# EAGLE design D&D_dice_1 (EAGLE 6.1)
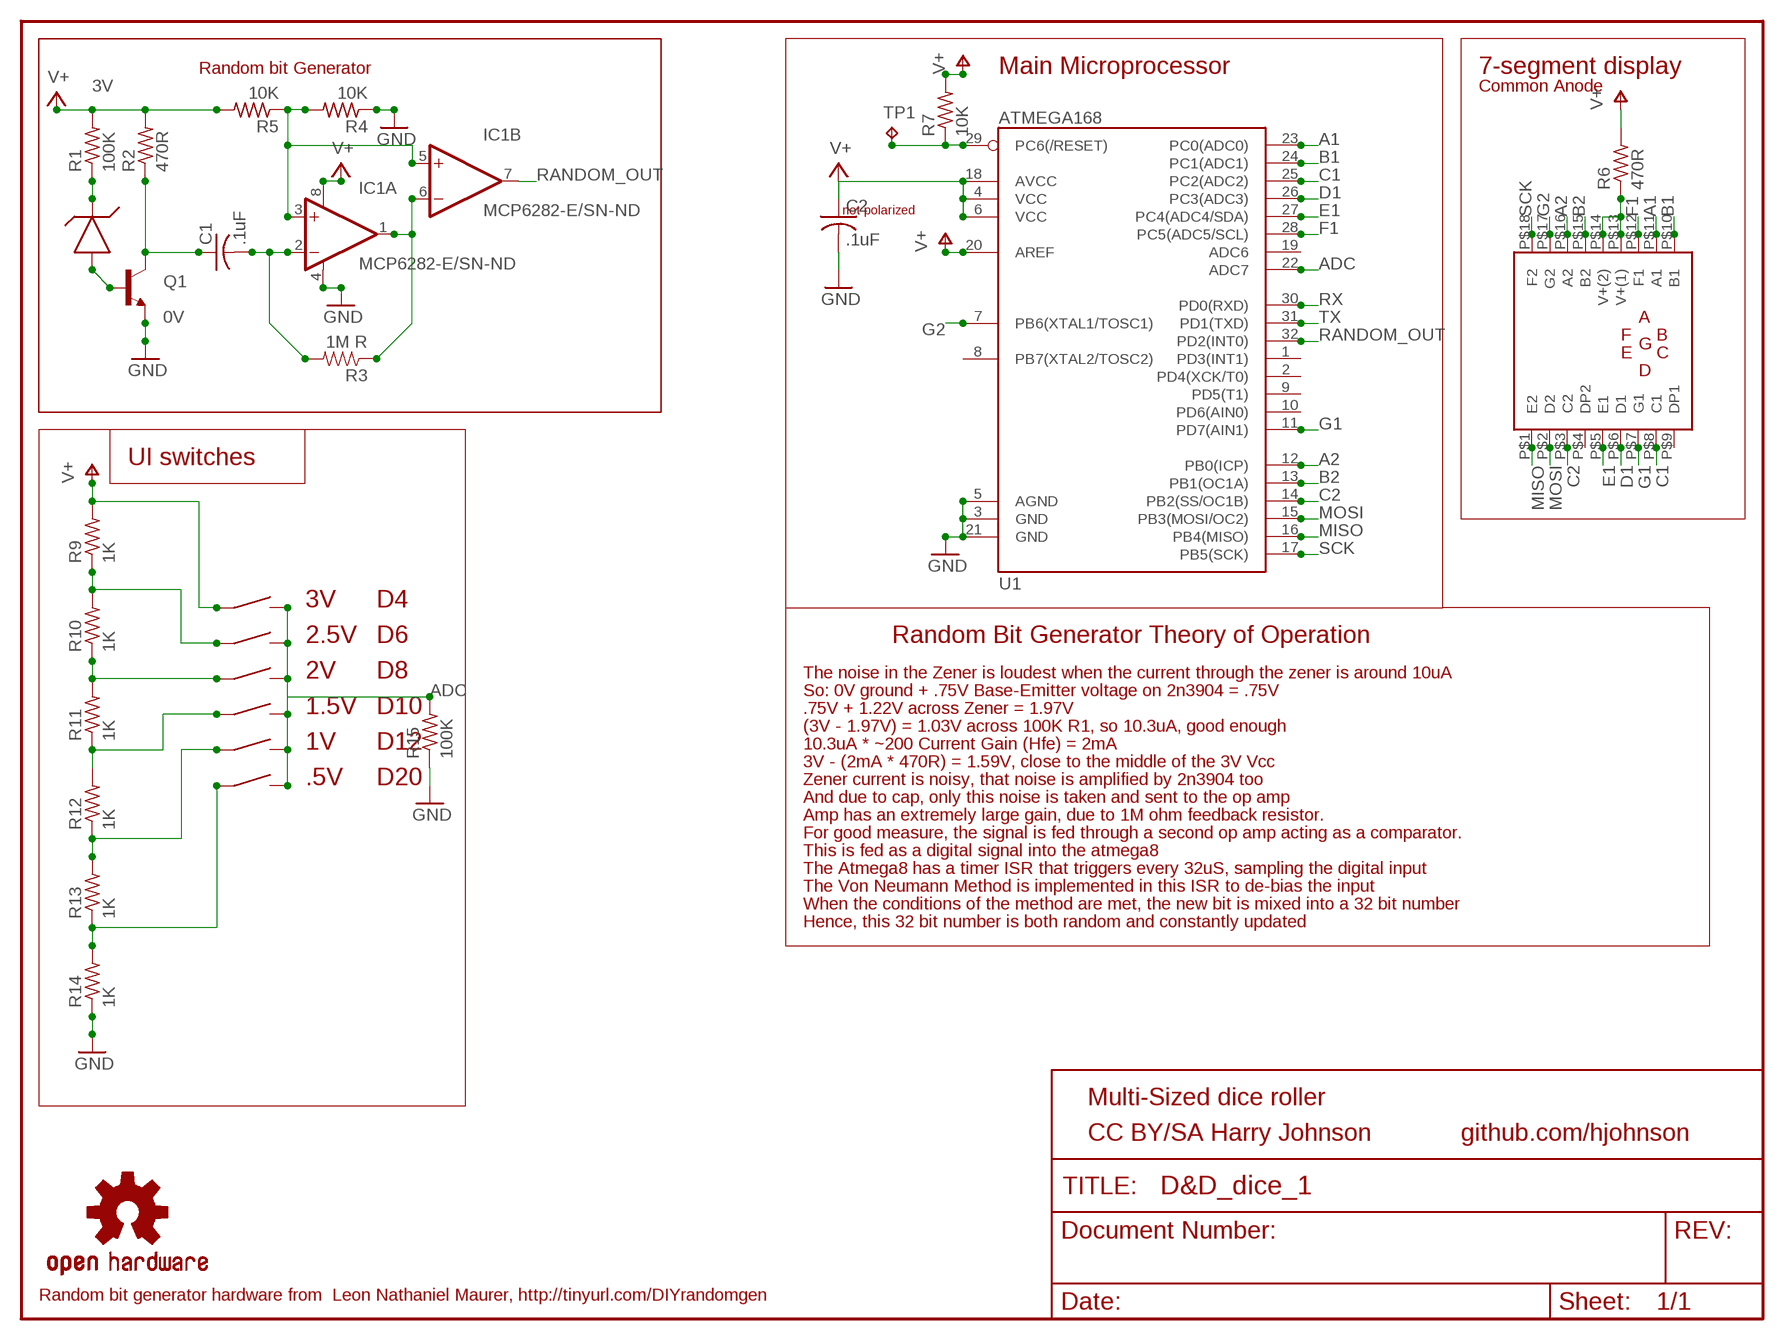
[diagram p0: schematic, sheet 1]

## Parts
C1  .1uF  C-USC0805  [C0805]
C2  .1uF  C-USC0805  [C0805]
IC1  MCP6282-E/SN-ND  OPA2340U  [SO08]
Q1  TRANSISTOR_NPNSOT23  [SOT23]
R1  100K  R-US_R0805  [R0805]
R2  470R  R-US_R0805  [R0805]
R3  1M R  RESISTOR0805-RES  [0805]
R4  10K  R-US_R0805  [R0805]
R5  10K  R-US_R0805  [R0805]
R6  470R  R-US_R0805  [R0805]
R7  10K  R-US_R0805  [R0805]
R9  1K  R-US_R0805  [R0805]
R10  1K  R-US_R0805  [R0805]
R11  1K  R-US_R0805  [R0805]
R12  1K  R-US_R0805  [R0805]
R13  1K  R-US_R0805  [R0805]
R14  1K  R-US_R0805  [R0805]
R15  100K  R-US_R0805  [R0805]
SW1  SPST_SWITCH  [EG2513-ND]
SW2  SPST_SWITCH  [EG2513-ND]
SW3  SPST_SWITCH  [EG2513-ND]
SW4  SPST_SWITCH  [EG2513-ND]
SW5  SPST_SWITCH  [EG2513-ND]
SW6  SPST_SWITCH  [EG2513-ND]
TP1  TPB1,27  [B1,27]
U1  ATMEGA168  [TQFP32-08]
U$1  ZXRE1004FFTA  [SOT23]
U$2  2DIGIT_7SEGMENT  [HDSP-521E]
U$3  OSHW-LOGOS  [OSHW-LOGO-S]

## Nets
/RES: R7.1 TP1.TP U1.29(PC6(/RESET))
A1: U1.23(PC0(ADC0)) U$2.P$11(A1)
A2: U1.12(PB0(ICP)) U$2.P$16(A2)
ADC: R15.2 SW1.P$2 SW2.P$2 SW3.P$2 SW4.P$2 SW5.P$2 SW6.P$2 U1.22(ADC7)
B1: U1.24(PC1(ADC1)) U$2.P$10(B1)
B2: U1.13(PB1(OC1A)) U$2.P$15(B2)
C1: U1.25(PC2(ADC2)) U$2.P$8(C1)
C2: U1.14(PB2(SS/OC1B)) U$2.P$3(C2)
D1: U1.26(PC3(ADC3)) U$2.P$6(D1)
E1: U1.27(PC4(ADC4/SDA)) U$2.P$5(E1)
F1: U1.28(PC5(ADC5/SCL)) U$2.P$12(F1)
G1: U1.11(PD7(AIN1)) U$2.P$7(G1)
G2: U1.7(PB6(XTAL1/TOSC1)) U$2.P$17(G2)
GND: C2.2 IC1.4(A:V-) Q1.2(E) R4.1 R14.1 R15.1 U1.3(GND) U1.5(AGND) U1.21(GND)
MISO: U1.16(PB4(MISO)) U$2.P$1(E2)
MOSI: U1.15(PB3(MOSI/OC2)) U$2.P$2(D2)
N$1: Q1.1(B) U$1.2(A)
N$2: C1.1 Q1.3(C) R2.1
N$3: R1.1 U$1.1(K)
N$4: C1.2 IC1.2(A:-IN) R3.2
N$5: IC1.1(A:OUT) IC1.6(B:-IN) R3.1
N$6: IC1.3(A:+IN) IC1.5(B:+IN) R4.2 R5.1
N$11: R6.1 U$2.P$13(V+(1)) U$2.P$14(V+(2))
RANDOM_OUT: IC1.7(B:OUT) U1.32(PD2(INT0))
ROLL_D6: R9.1 R10.2 SW2.P$1
ROLL_D8: R10.1 R11.2 SW3.P$1
ROLL_D10: R11.1 R12.2 SW4.P$1
ROLL_D12: R12.1 R13.2 SW5.P$1
ROLL_D20: R13.1 R14.2 SW6.P$1
RX: U1.30(PD0(RXD))
SCK: U1.17(PB5(SCK)) U$2.P$18(F2)
TX: U1.31(PD1(TXD))
V+: C2.1 IC1.8(A:V+) R1.2 R2.2 R5.2 R6.2 R7.2 R9.2 SW1.P$1 U1.4(VCC) U1.6(VCC) U1.18(AVCC) U1.20(AREF)
Unconnected: U1.1(PD3(INT1)) U1.2(PD4(XCK/T0)) U1.8(PB7(XTAL2/TOSC2)) U1.9(PD5(T1)) U1.10(PD6(AIN0)) U1.19(ADC6) U$2.P$4(DP2) U$2.P$9(DP1)

## Notes on the sheet
- Random bit Generator | Main Microprocessor | 7-segment display
- 3V | Common Anode
- not polarized
- 0V
- UI switches
- 3V | D4
- 2.5V | D6 | Random Bit Generator Theory of Operation
- 2V | D8 | The noise in the Zener is loudest when the current through the zener is around 10uA
- So: 0V ground + .75V Base-Emitter voltage on 2n3904 = .75V
- 1.5V | D10 | .75V + 1.22V across Zener = 1.97V
- (3V - 1.97V) = 1.03V across 100K R1, so 10.3uA, good enough
- 1V | D12 | 10.3uA * ~200 Current Gain (Hfe) = 2mA
- 3V - (2mA * 470R) = 1.59V, close to the middle of the 3V Vcc
- .5V | D20 | Zener current is noisy, that noise is amplified by 2n3904 too
- And due to cap, only this noise is taken and sent to the op amp
- Amp has an extremely large gain, due to 1M ohm feedback resistor.
- For good measure, the signal is fed through a second op amp acting as a comparator.
- This is fed as a digital signal into the atmega8
- The Atmega8 has a timer ISR that triggers every 32uS, sampling the digital input
- The Von Neumann Method is implemented in this ISR to de-bias the input
- When the conditions of the method are met, the new bit is mixed into a 32 bit number
- Hence, this 32 bit number is both random and constantly updated
- Multi-Sized dice roller
- CC BY/SA Harry Johnson | github.com/hjohnson
- Random bit generator hardware from  Leon Nathaniel Maurer, http://tinyurl.com/DIYrandomgen

## Library data of the parts
C1 C2 = adafruit:C-US: CAPACITOR, American symbol
IC1 = burr-brown:OPA2340: Single-Supply, Rail-to-Rail Operational Amplifiers MicroAmplifier(TM) Series; Product Folder:OPA2340; MF: TEXAS INSTRUMENTS; MPN: OPA2340UA; OC_FARNELL: 1101541; OC_NEWARK: 36K7581
Q1 = SparkFun:TRANSISTOR_NPN: Transistor NPN BJT configuration in SOT23 package. MMBT2222 is the common NPN we use. Double check BCE configuration again layout.
R1 R2 R4-R7 R9-R15 = adafruit:R-US_: RESISTOR, American symbol
R3 = SparkFun:RESISTOR: Resistor Basic schematic elements and footprints for 0603, 1206, and PTH resistors.
SW1-SW6 = hjohnson_library:SPST_SWITCH
TP1 = testpad:TP: Test pad
U1 = SparkFun:ATMEGA168
U$1 = hjohnson_library:ZXRE1004FFTA
U$2 = hjohnson_library:2DIGIT_7SEGMENT
U$3 = SparkFun:OSHW-LOGO: Open Source Hardware Logo This logo indicates the piece of hardware it is found on incorporates a OSHW license and/or adheres to the definition of open source hardware found here: http://freedomdefined.org/OSHW

## Board
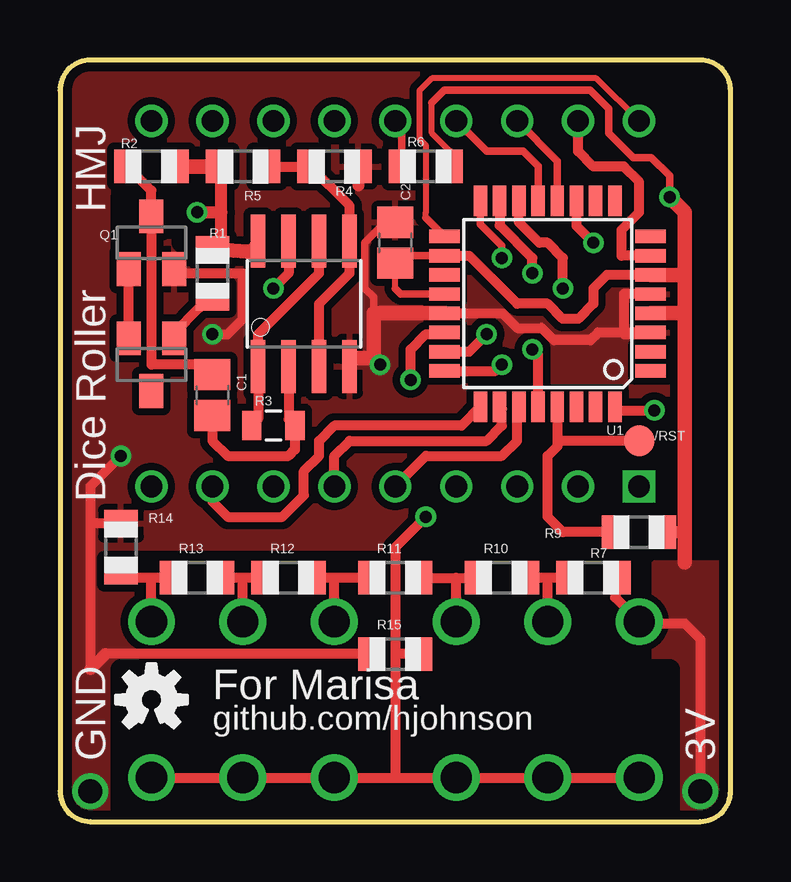
[diagram p1: board, top side]
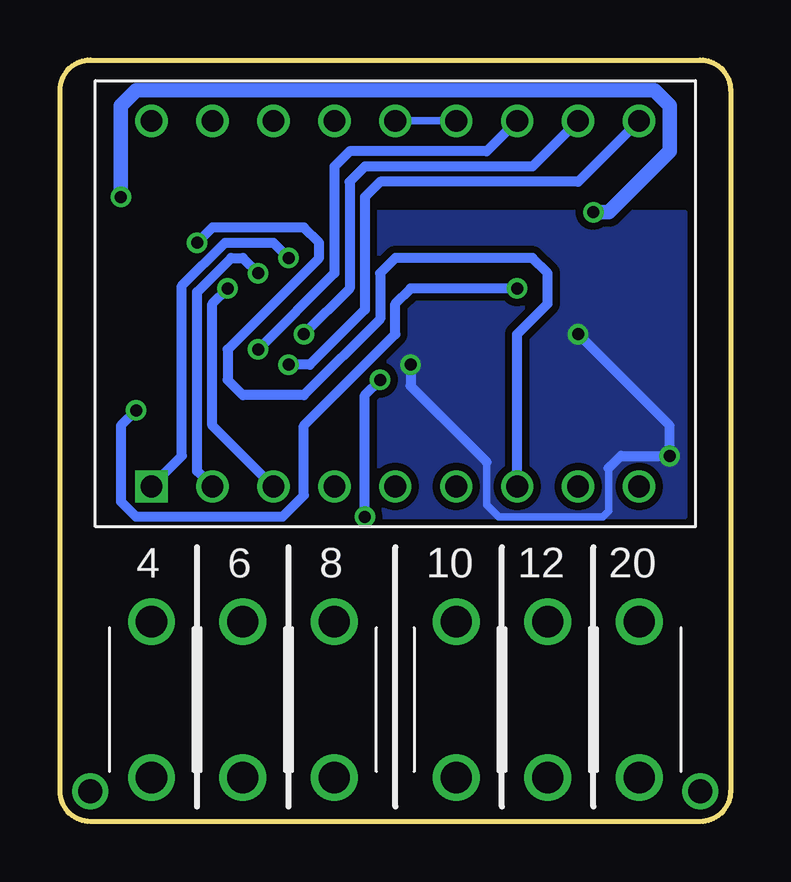
[diagram p2: board, bottom side, seen from below]

Size 27.94 x 31.75 mm. Coordinates in mm from the lower left corner, seen from the top.
Outline: 0,30.48 0,1.27 arc90 1.27,0 26.67,0 arc90 27.94,1.27 27.94,30.48 arc90 26.67,31.75 1.27,31.75 arc90 0,30.48
Copper layers (1*16): Top 0.0356mm / dielectric 1.5011mm / Bottom 0.0356mm
Design rules: minimum track width 6mil, minimum drill 13mil, track to track 6mil, track to pad 6mil, pad to pad 6mil, via to via 6mil, smd to smd 6mil, copper to edge 15mil, drill to drill 6mil, minimum pad ring 7mil, minimum via ring 7mil, stop-mask expansion 4mil, vias tented up to drill 0mil, thermal gap 10mil
tRestrict: 23 lines

### Footprints (pad centres in the part's own frame; a part is rotated, then mirrored left to right if it is on the bottom)
C0805 = smd 1.3 x 1.5: 1 -0.85,0; 2 0.85,0
SO08 = smd 0.61 x 2.21: 1 -1.905,-2.616; 2 -0.635,-2.616; 3 0.635,-2.616; 4 1.905,-2.616; 5 1.905,2.616; 6 0.635,2.616; 7 -0.635,2.616; 8 -1.905,2.616
SOT23 = smd 1 x 1.4: 1 -0.95,-1.1; 2 0.95,-1.1; 3 0,1.1
R0805 = smd 1.1 x 1.4: 1 -1,0; 2 1,0
0805 = smd 0.8 x 1.2: 1 -0.9,0; 2 0.9,0
EG2513-ND = drill 1.3: P$1 -3.25,0; P$2 3.25,0
B1,27 = smd 1.27 x 1.27: TP 0,0
TQFP32-08 = smd 1.27 x 0.559: 1 -4.293,2.8; 2 -4.293,2; 3 -4.293,1.2; 4 -4.293,0.4; 5 -4.293,-0.4; 6 -4.293,-1.2; 7 -4.293,-2; 8 -4.293,-2.8; 17 4.293,-2.8; 18 4.293,-2; 19 4.293,-1.2; 20 4.293,-0.4; 21 4.293,0.4; 22 4.293,1.2; 23 4.293,2; 24 4.293,2.8 | smd 0.559 x 1.27: 9 -2.8,-4.293; 10 -2,-4.293; 11 -1.2,-4.293; 12 -0.4,-4.293; 13 0.4,-4.293; 14 1.2,-4.293; 15 2,-4.293; 16 2.8,-4.293; 25 2.8,4.293; 26 2,4.293; 27 1.2,4.293; 28 0.4,4.293; 29 -0.4,4.293; 30 -1.2,4.293; 31 -2,4.293; 32 -2.8,4.293
HDSP-521E = drill 0.9 square: P$1 -10.16,-7.62 | drill 0.9: P$2 -7.62,-7.62; P$3 -5.08,-7.62; P$4 -2.54,-7.62; P$5 0,-7.62; P$6 2.54,-7.62; P$7 5.08,-7.62; P$8 7.62,-7.62; P$9 10.16,-7.62; P$10 10.16,7.62; P$11 7.62,7.62; P$12 5.08,7.62; P$13 2.54,7.62; P$14 0,7.62; P$15 -2.54,7.62; P$16 -5.08,7.62; P$17 -7.62,7.62; P$18 -10.16,7.62

### Placement (x,y rotation side)
C1  6.35,17.78 270 top
C2  13.97,24.13 90 top
IC1  10.16,21.59 0 top
Q1  3.81,24.13 0 top
R1  6.35,22.86 90 top
R2  3.81,27.3 0 top
R3  8.89,16.51 0 top
R4  11.43,27.3 180 top
R5  7.62,27.3 180 top
R6  15.24,27.3 0 top
R7  24.13,12.06 0 top
R9  22.23,10.16 0 top
R10  18.41,10.16 0 top
R11  13.97,10.16 0 top
R12  9.53,10.16 0 top
R13  5.71,10.16 0 top
R14  2.54,11.43 270 top
R15  13.97,6.99 0 top
SW1  24.13,5.08 270 bottom
SW2  20.32,5.08 270 bottom
SW3  16.51,5.08 270 bottom
SW4  11.43,5.08 270 bottom
SW5  7.62,5.08 270 bottom
SW6  3.81,5.08 270 bottom
TP1  24.13,15.88 0 top
U1  20.32,21.59 180 top
U$1  3.81,19.05 180 top
U$2  13.97,21.59 0 bottom
U$3  3.81,5.08 0 top

### Tracks (layer width: path | path; a pad name or v marks a point on that pad's centre or on a via)
/RES
  Top 0.406: R7.1 20.95,12.06 20.32,12.7 20.32,15.24 20.72,15.64 20.72,15.88 | U1.29 20.72,15.88 | TP1.TP 20.72,15.88
A1  (via drill 0.5)
  Top 0.406: U1.23 17.05,19.59 v17.78,20.32
  Bottom 0.406: U$2.P$11 8.26,27.3 15.24,27.3 15.88,26.67 15.88,22.23 v17.78,20.32
A2
  Top 0.305: U$2.P$16 20.72,27.54 U1.12
ADC  (via drill 0.5)
  Top 0.406: SW6.P$2 SW5.P$2 SW4.P$2 13.97,1.83 | 13.97,1.83 SW3.P$2 SW2.P$2 SW1.P$2 | v15.24,12.7 13.97,11.43 13.97,6.99 | 13.97,6.99 13.97,1.83 | R15.2 13.97,6.99 | v14.61,18.41 14.61,19.68 15.24,20.32 15.96,20.32 U1.22
  Bottom 0.406: v15.24,12.7 15.24,17.78 v14.61,18.41
B1  (via drill 0.5)
  Top 0.406: U1.24 18.16,18.79 v18.41,19.05
  Bottom 0.406: U$2.P$10 6.35,26.67 14.61,26.67 15.24,26.04 15.24,21.34 17.53,19.05 v18.41,19.05
B2
  Top 0.305: U$2.P$15 17.78,27.94 19.3,27.94 19.92,27.32 U1.13
C1
  Top 0.406: U$2.P$8 6.35,13.34 6.99,12.7 9.26,12.7 10.16,13.6 10.16,14.61 10.79,15.24 10.79,15.88 11.43,16.51 16.73,16.51 U1.25
C2  (via drill 0.5)
  Top 0.254: U1.14 19.12,25.47
  Top 0.406: 19.05,25.4 19.12,25.47 19.12,24.98 19.97,24.13 20.32,24.13 20.95,23.5 v20.95,22.23
  Bottom 0.406: U$2.P$3 21.59,16.51 21.59,21.59 v20.95,22.23
D1
  Top 0.254: 18.41,17.2 U1.26
  Top 0.406: U$2.P$6 11.43,15.24 12.06,15.88 17.78,15.88 18.41,16.51 18.41,17.2
E1
  Top 0.254: 19.05,17.23 U1.27
  Top 0.406: U$2.P$5 15.24,15.24 18.41,15.24 19.05,15.88 19.05,17.23
F1  (via drill 0.5)
  Top 0.406: U1.28 19.92,19.45 v19.68,19.68
  Bottom 0.406: v19.68,19.68 16.51,22.86 16.51,27.3 15.88,27.94 10.16,27.94 U$2.P$12
G1  (via drill 0.5)
  Top 0.406: U1.11 21.52,24.84 v22.23,24.13
  Bottom 0.406: U$2.P$7 8.89,20.32 7.62,21.59 7.62,22.86 8.26,23.5 13.97,23.5 14.61,22.86 14.61,20.95 17.78,17.78 20.32,17.78 20.95,18.41 20.95,19.68 17.14,23.5 17.14,24.13 17.78,24.77 21.59,24.77 v22.23,24.13
G2
  Top 0.406: U1.7 23.4,23.59 23.4,24.67 24.13,25.4 24.13,26.67 23.5,27.3 22.23,27.3 21.59,27.94 U$2.P$17
GND  (via drill 0.5, 1)
  Top 0.254: 5.08,22.86 4.91,23.03 Q1.2 4.76,22.86 | 12.06,19.05 IC1.4
  Top 0.305: 13.07,21.19 13.07,21.86 12.7,22.23 12.7,24.13 13.55,24.98
  Top 0.406: v2.54,15.24 1.27,13.97 1.27,12.43 | v6.35,20.32 6.99,20.32 7.62,20.95 7.62,22.86 4.76,22.86 | 1.27,12.43 1.27,6.35 | R15.1 1.91,6.99 | R14.1 1.27,12.43 | U1.5 23.5,21.99 23.5,20.32 24.61,20.32 U1.3 22.42,20.39 22.1,20.07 20.57,20.07 20.07,20.57 19.05,20.57 18.43,21.19 U1.21 | 13.07,19.32 v13.34,19.05
  Top 0.508: R4.1 12.43,26.52 | 1.91,6.99 1.27,6.35
  Top 0.61: U1.21 13.07,21.19 13.07,19.32 12.06,19.32 IC1.4
  Bottom 0.305: 10.16,14.99 10.16,13.21 9.65,12.7 5.33,12.7 5.08,12.95 5.08,14.73
  Bottom 0.406: v6.35,20.32 2.54,16.51 v2.54,15.24 4.57,15.24 5.08,14.73 | 10.16,14.99 13.34,18.16 v13.34,19.05
  other vias: 1.27,1.27
  pour Bottom (isolate 0.305): 1.91,12.7 26.04,12.7 26.04,25.4 1.91,25.4
  pour Top (isolate 0.305): 0,0 3.17,0 3.17,11.43 27.94,11.43 27.94,31.75 0,31.75
MISO  (via drill 0.5)
  Top 0.305: U1.16 17.52,24.9 18.41,24 v18.41,23.5
  Bottom 0.406: v18.41,23.5 19.05,24.13 21.06,24.13 22.86,22.33 22.86,15.24 U$2.P$1
MOSI  (via drill 0.5)
  Top 0.406: v19.68,22.86 19.68,23.5 18.32,24.86 U1.15
  Bottom 0.406: v19.68,22.86 20.32,23.5 20.8,23.5 22.23,22.07 22.23,14.61 U$2.P$2
N$1
  Top 0.406: U$1.2 Q1.1
N$2
  Top 0.406: 2.54,27.3 R2.1 3.81,26.3 Q1.3 3.81,19.05 5.71,19.05 6.13,18.63 C1.1
N$3
  Top 0.406: R1.1 5.81,21.42 4.76,20.37 U$1.1
N$4
  Top 0.406: IC1.2 9.53,16.77 R3.2 9.79,15.51 9.53,15.24 6.99,15.24 6.35,15.88 C1.2
N$5
  Top 0.406: IC1.6 10.79,22.86 8.26,20.32 IC1.1 8.26,16.77 R3.1
N$6
  Top 0.406: R5.1 R4.2 12.06,25.67 IC1.5 12.06,22.86 10.79,21.59 IC1.3
N$11
  Top 0.305: R6.1 14.24,28.94 U$2.P$14
  Bottom 0.305: U$2.P$13 U$2.P$14
RANDOM_OUT  (via drill 0.5)
  Top 0.406: U1.32 23.27,17.14 v24.77,17.14 | IC1.7 9.53,22.86 v8.89,22.23
  Bottom 0.406: v8.89,22.23 13.34,22.23 13.97,21.59 13.97,20.32 17.78,16.51 17.78,13.6 18.68,12.7 24.77,12.7 25.4,13.34 25.4,16.51 v24.77,17.14
ROLL_D6
  Top 0.406: R9.1 20.32,10.16 | 20.32,10.16 R10.2 | SW2.P$1 20.32,10.16
ROLL_D8
  Top 0.406: R11.2 16.51,10.16 | 16.51,10.16 R10.1 | SW3.P$1 16.51,10.16
ROLL_D10
  Top 0.406: R11.1 11.43,10.16 | 11.43,10.16 R12.2 | SW4.P$1 11.43,10.16
ROLL_D12
  Top 0.406: R12.1 7.62,10.16 | 7.62,10.16 R13.2 | SW5.P$1 7.62,10.16
ROLL_D20
  Top 0.406: R13.1 3.81,10.16 | 3.81,10.16 2.54,10.16 R14.2 | SW6.P$1 3.81,10.16
SCK
  Top 0.254: U$2.P$18 22.35,30.99 15.49,30.99 14.99,30.48 14.99,28.45 15.24,28.19 15.24,25.4 15.24,25.18 15.24,25.15
  Top 0.305: 15.24,25.18 U1.17
V+  (via drill 0.5, 1)
  Top 0.254: 16,21.96 U1.20 | 24.13,8.26 SW1.P$1 | 16.24,27.45 16.24,27.96 15.49,28.7 15.49,29.97 | 13.97,22.23 C2.1 13.97,23.59 14.28,23.59
  Top 0.305: U1.20 14.21,21.99 13.97,22.23 | U1.18 14.28,23.59 | R6.2 16.24,27.45 | 15.49,29.97 16,30.48 22.1,30.48 22.86,29.72 22.86,28.7 23.88,27.69 24.64,27.69 25.4,26.92 v25.4,26.04
  Top 0.406: IC1.8 8.26,23.5 | 6.72,24.13 R1.2 | 24.13,8.26 26.04,8.26 26.67,7.62 v26.67,1.27 | R9.2 23.12,9.34 SW1.P$1 | U1.6 22.79,22.79 22.23,22.23 22.23,21.59 21.59,20.95 20.95,20.95 20.32,21.59 19.05,21.59 17.05,23.59 U1.18
  Top 0.508: R7.2 26.04,12.06 | 6.72,24.13 6.72,25.4 | 6.72,25.4 6.72,27.2 R5.2 | v5.71,25.4 6.72,25.4
  Top 0.61: R1.2 7.81,23.76 arc90 IC1.8 | R5.2 R2.2 | v25.4,26.04 26.04,25.4 26.04,22.79 | 26.04,22.79 26.04,21.19 | 26.04,21.19 26.04,12.06 26.04,10.79 | U1.4 26.04,21.19 | U1.6 26.04,22.79
  Bottom 0.61: v5.71,25.4 5.08,25.4 2.54,27.94 2.54,29.84 3.17,30.48 24.77,30.48 25.4,29.84 v25.4,26.04
  pour Top (isolate 0.305): 24.77,0 24.77,10.79 27.94,10.79 27.94,0

### Text on the board
tPlace: HMJ | /RST | Dice Roller | For Marisa | github.com/hjohnson | GND | 3V
bPlace: 20 | 12 | 10 | 8 | 6 | 4